# Altium schematic sheet ATMEGA.SchDoc
size A4; SheetNumber: 3; SheetTotal: 6
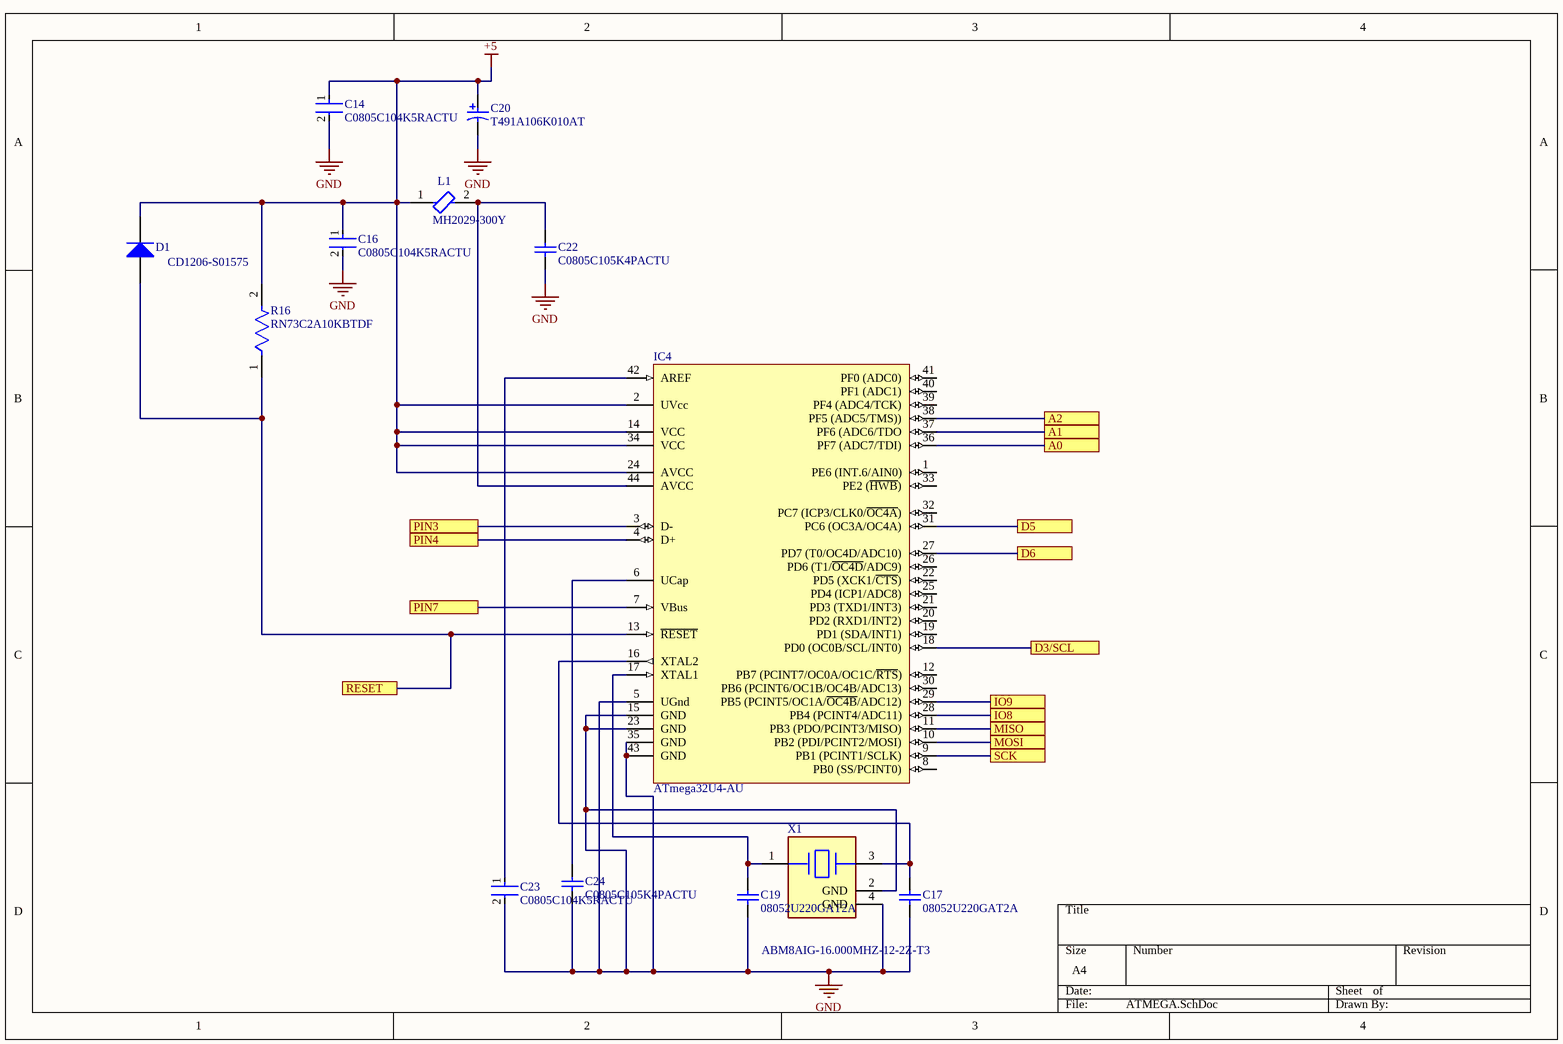
[diagram p0: ATMEGA.SchDoc]

## Parts
C14  C0805C104K5RACTU  [FP-C0805C-DN-MFG]
C16  C0805C104K5RACTU  [FP-C0805C-DN-MFG]
C17  08052U220GAT2A  [CAPC2013X115X51NL20T26]
C19  08052U220GAT2A  [CAPC2013X115X51NL20T26]
C20  T491A106K010AT  [KEMT-A-3216-18-2_M]
C22  C0805C105K4PACTU  [CAPC2013X145X50LL20T25]
C23  C0805C104K5RACTU  [FP-C0805C-DN-MFG]
C24  C0805C105K4PACTU  [CAPC2013X145X50LL20T25]
D1  CD1206-S01575  [BOUR-CD1206-S01575-2_L]
IC4  ATmega32U4-AU  [44ML_M]
L1  MH2029-300Y  [FP-MH2029-MFG]
R16  RN73C2A10KBTDF  [FP-RN732A-MFG]
X1  ABM8AIG-16.000MHZ-12-2Z-T3  [FP-ABM8AIG-MFG]

## Ports
A0, A1, A2, D3/SCL, D5, D6, IO8, IO9, MISO, MOSI, PIN3, PIN4, PIN7, RESET, SCK

## Nets
+5: C14.1 C16.1 C20.1 D1.2(K) IC4.2(UVcc) IC4.14(VCC) IC4.24(AVCC) IC4.34(VCC) L1.1 R16.2
GND: C14.2 C16.2 C17.1 C19.1 C20.2 C22.1 C23.2 C24.1 IC4.5(UGnd) IC4.15(GND) IC4.23(GND) IC4.35(GND) IC4.43(GND) X1.2(GND) X1.4(GND)
A0: IC4.36(PF7_(ADC7/TDI)) ; port A0
A1: IC4.37(PF6_(ADC6/TDO) ; port A1
A2: IC4.38(PF5_(ADC5/TMS))) ; port A2
D3/SCL: IC4.18(PD0_(OC0B/SCL/INT0)) ; port D3/SCL
D5: IC4.31(PC6_(OC3A/OC4A)) ; port D5
D6: IC4.27(PD7_(T0/OC4D/ADC10)) ; port D6
IO8: IC4.28(PB4_(PCINT4/ADC11)) ; port IO8
IO9: IC4.29(PB5_(PCINT5/OC1A/~{OC4B}/ADC12)) ; port IO9
MISO: IC4.11(PB3_(PDO/PCINT3/MISO)) ; port MISO
MOSI: IC4.10(PB2_(PDI/PCINT2/MOSI)) ; port MOSI
PIN3: IC4.3(D-) ; port PIN3
PIN4: IC4.4(D+) ; port PIN4
PIN7: IC4.7(VBus) ; port PIN7
RESET: D1.1(A) IC4.13(~{RESET}) R16.1 ; port RESET
SCK: IC4.9(PB1_(PCINT1/SCLK)) ; port SCK
NetC17_2: C17.2 IC4.16(XTAL2) X1.3(2_Crystal)
NetC19_2: C19.2 IC4.17(XTAL1) X1.1(1_Crystal)
NetC22_2: C22.2 IC4.44(AVCC) L1.2
NetC23_1: C23.1 IC4.42(AREF)
NetC24_2: C24.2 IC4.6(UCap)

Not connected (* = marked no-connect by the designer): IC4 1(PE6_(INT.6/AIN0)) 8(PB0_(SS/PCINT0)) 12(PB7_(PCINT7/OC0A/OC1C/~{RTS})) 19(PD1_(SDA/INT1)) 20(PD2_(RXD1/INT2)) 21(PD3_(TXD1/INT3)) 22(PD5_(XCK1/~{CTS})) 25(PD4_(ICP1/ADC8)) 26(PD6_(T1/~{OC4D}/ADC9)) 30(PB6_(PCINT6/OC1B/OC4B/ADC13)) 32(PC7_(ICP3/CLK0/~{OC4A})) 33(PE2_(~{HWB})) 39(PF4_(ADC4/TCK)) 40(PF1_(ADC1)) 41(PF0_(ADC0))

## Library data of the parts
C14 C16 C23 = CMP-2007-00279-2: CAP CER 0.1UF 50V X7R 0805; Manufacturer: KEMET; Value: 0.10 μF; Tolerance: 0.1; Temperature Coefficient: 30ppm/°C; Material: Ceramic; Manufacturer Part Number: C0805C104K5RACTU; Device Class L2: Capacitors; Temperature Range Low: -55°C; Voltage Rating: 50 V; Digikey Description: CAP CER 0.1UF 50V X7R 0805; Category: Cap; ComponentLink2Description: Datasheet; Octopart: https://octopart.com/c0805c104k5ractu-kemet-143926; RoHS: TRUE; ComponentLink2URL: https://content.kemet.com/datasheets/KEM_C1003_C0G_SMD.pdf; Temperature Characteristic: X7R; Temperature: -55°C to +125°C; Height: 0.88mm; Temperature Range High: +125°C; Device Class L1: Passive Components; Automotive: No; Lead Free: Yes; Ipc Land Pattern Name: CAPC200125X78; Device Class L3: Ceramic Capacitors; Mouser Description: Cap Ceramic 0.1uF 50V X7R 10% SMD 2.0 x 1.2 mm 125 C Paper T/R; Capacitance: 0.10 μF; Package: C0805C-DN
C17 C19 = CMP-2007-04866-1: Manufacturer: AVX Interconnect / Elco; Part Number: 08052U220GAT2A
C20 = CMP-2000-05172-1: Capacitor, Tantalum, 10 uF, +/- 10%, 10 V, -55 to 125 degC, 2-Pin SMD (1206), RoHS, Tape and Reel; Manufacturer Size Code: A; Manufacturer: Kemet; Type: Molded; Online Catalog: T491Series; Other Names: 399-3684-2; Voltage - Rated: 10V; Lifetime @ Temp.: 2000Hrs@85degC; Product Training Modules: CapacitorBasics-TypicalUsesforCapacitorsDeratingGuidelinesforSurfaceMountTantalumCapacitors; ESR (Equivalent Series Resistance): 3.8Ohm; Capacitance: 10µF; Catalog Drawings: T49x,T5xxSeries_A-side1T49x,T5xxSeries_A,B-side2T49x,T5xxSeries_A,SBottom; Family: TantalumCapacitors; Manufacturer URL: http://www.kemet.com/; Datasheet URL: http://www.farnell.com/datasheets/1824869.pdf; Package Reference: 1206; Packaging: Tape&Reel(TR); Series: T491; Operating Temperature: -55degC~125degC; Mounting Type: SurfaceMount; Height - Seated (Max): 0.071"(1.80mm); Package / Case: 1206(3216Metric); Package Description: 2-Pin Surface Mount Device, Body 3.2 x 1.6 mm; Features: GeneralPurpose; Tolerance: ±10%; Lead Spacing: -; Size / Dimension: 0.126"Lx0.063"W(3.20mmx1.60mm); Standard Package: 2,000; Datasheet Version: Apr-14; Category: Capacitors
C22 C24 = CMP-1036-04746-2: Manufacturer: Kemet; Part Number: C0805C105K4PACTU
D1 = CMP-0583-00001-2: 75 V Small Signal Switching Diode, 150 mA, 2.5 uA, 1026 Molded Package, RoHS, Tape and Reel; Manufacturer: Bourns; Reverse Voltage: 75 V; Average Forward Current: 150 mA; Reverse Current (Max.): 2.5 uA; Capacitance Between Terminals (Max.): 3 pF; Reverse Recovery Time (Max.): 4 nS; Forward Voltage (Max.): 1.00 V; Packing: Tape and Reel; Mounting Technology: Surface Mount; DatasheetVersion: Rev. 06/11; ComponentLink2URL: http://www.bourns.com/data/global/pdfs/CD1206_S01575.pdf; PackageReference: CD1206-S01575-2; RoHS: TRUE; ComponentLink1URL: http://www.bourns.com/; ComponentLink1Description: Manufacturer URL; ComponentLink3Description: Package Specification; ComponentLink3URL: http://www.bourns.com/data/global/pdfs/CD1206_S01575.pdf; ComponentLink2Description: Datasheet; PackageDescription: 2-Pin SMD, Body 3.2 x 1.5 mm; PartNumber: CD1206-S01575
IC4 = CMP-0095-00285-2: 8-bit AVR Microcontroller, 2.7-5.5V, 16MHz, 32KB Flash, 1KB EEPROM, 2.5KB SRAM, USB Controller, 44-pin TQFP, Industrial Grade (-40°C to 85°C), Ext Osc; RevisionNote: DatasheetVersion updated. URLs added.; ComponentLink1Description: Manufacturer URL; PackageDescription: 44-Pin Plastic Thin Quad Flat Pack, 10 x 10 x 1.0 mm Body, 0.8 mm Pitch (TQFP); DatasheetVersion: revF, Nov-2010; ComponentLink2URL: http://www.atmel.com/dyn/resources/prod_documents/doc7766.pdf; ComponentLink1URL: http://www.atmel.com/; PackageReference: 44ML; ComponentLink2Description: ATmega16U4/32U4 Datasheet; PackageVersion: rev.G, Jul-2007; ComponentLink3URL: http://www.atmel.com/dyn/resources/prod_documents/7766S.pdf; ComponentLink3Description: ATmega16U4 ATmega32U4 Summary
L1 = CMP-07252-000001-1: FERRITE BEAD 30 OHM 0805 1LN; Manufacturer: Bourns; Series Resistance: 25mΩ; Resistance: 30Ω; Value: 30Ω; Impedance At Frequency: 30Ω @ 100MHz; Rms Current: 3A; Tolerance: 25%; RoHS: TRUE; Manufacturer Part Number: MH2029-300Y; Temperature Range High: +125°C; Device Class L3: Ferrite Beads and Chips; Core Material: Ferrite; ComponentLink2Description: Datasheet; Category: FBead; Octopart: https://octopart.com/mh2029-300y-bourns-756929; Digikey Description: FERRITE BEAD 30 OHM 0805 1LN; Device Class L2: EMI / RFI Components; Lead Free: Yes; Mouser Description: Ferrite Beads 30 ohms 25% HIGH CURRENT; Automotive: No; Ipc Land Pattern Name: CAPC200120X90; Temperature: -55°C to +125°C; Device Class L1: Passive Components; Height: 1.1mm; ComponentLink2URL: https://www.bourns.com/docs/Product-Datasheets/mh.pdf; Package: MH2029; Temperature Range Low: -55°C
R16 = CMP-03211-000130-1: SMD Chip Resistor, Thin Film, 10KΩ, 100 V, 0805 [2012 Metric], 100 mW, 0.1%, RN73 Series; Manufacturer: TE Connectivity; Power Rating: 0.1W; Temperature Coefficient: 10ppm/°C; Voltage Rating: 100V; Package: RN732A; Ipc Land Pattern Name: RESC200125X55; RoHS: TRUE; packaging: 1000 Reel; Resistance: 10KΩ; Octopart: https://octopart.com/rn73c2a10kbtdf-te+connectivity-21400356; Temperature Range Low: -55°C; Device Class L1: Passive Components; Tolerance: 0.1%; ComponentLink2URL: https://www.te.com/commerce/DocumentDelivery/DDEController?Action=showdoc&DocId=Data+Sheet%7F1773270%7FP%7Fpdf%7FEnglish%7FENG_DS_1773270_P.pdf%7F1676162-2; Height: 0.65mm; Composition: Thin Film; Temperature Range High: 155°C; Automotive: No; Series: RN73; Lead Free: Yes; Value: 10KΩ; Category: Res; Device Class L2: Resistors; Temperature: -55°C to 155°C; octopart_url: https://octopart.com/rn73c2a10kbtdf-te+connectivity-21400356; Device Class L3: Chip SMD Resistors; ComponentLink2Description: Datasheet; Manufacturer Part Number: RN73C2A10KBTDF
X1 = CMP-27762-000014-1: CRYSTAL 16MHZ 12PF SMD; Manufacturer: Abracon LLC; Automotive Grade: Grade 1; Stability: 50ppm; Tolerance: 20ppm; Esr: 70Ω; Load Capacitance: 12pF; Category: Crys; ComponentLink2Description: Datasheet; RoHS: TRUE; Temperature Range High: +125°C; Lead Free: Yes; Digikey Description: CRYSTAL 16MHZ 12PF SMD; Octopart: https://octopart.com/abm8aig-16.000mhz-12-2z-t3-abracon-70466545; Series: ABM8AIG; Manufacturer Part Number: ABM8AIG-16.000MHZ-12-2Z-T3; Automotive: Yes; Device Class L1: Passive Components; Mouser Description: Crystals 16MHz AECQ200 12pF 20ppm -40C +125C; Device Class L2: Crystals / Oscillators; ComponentLink2URL: https://abracon.com/AIGcrystals/ABM8AIG.pdf; Frequency: 16MHz; Package: ABM8AIG; Height: 0.8mm; Device Class L3: Crystals; Temperature Range Low: -40°C; Temperature: -40°C to +125°C